# EAGLE design mend (EAGLE 7.2.0)
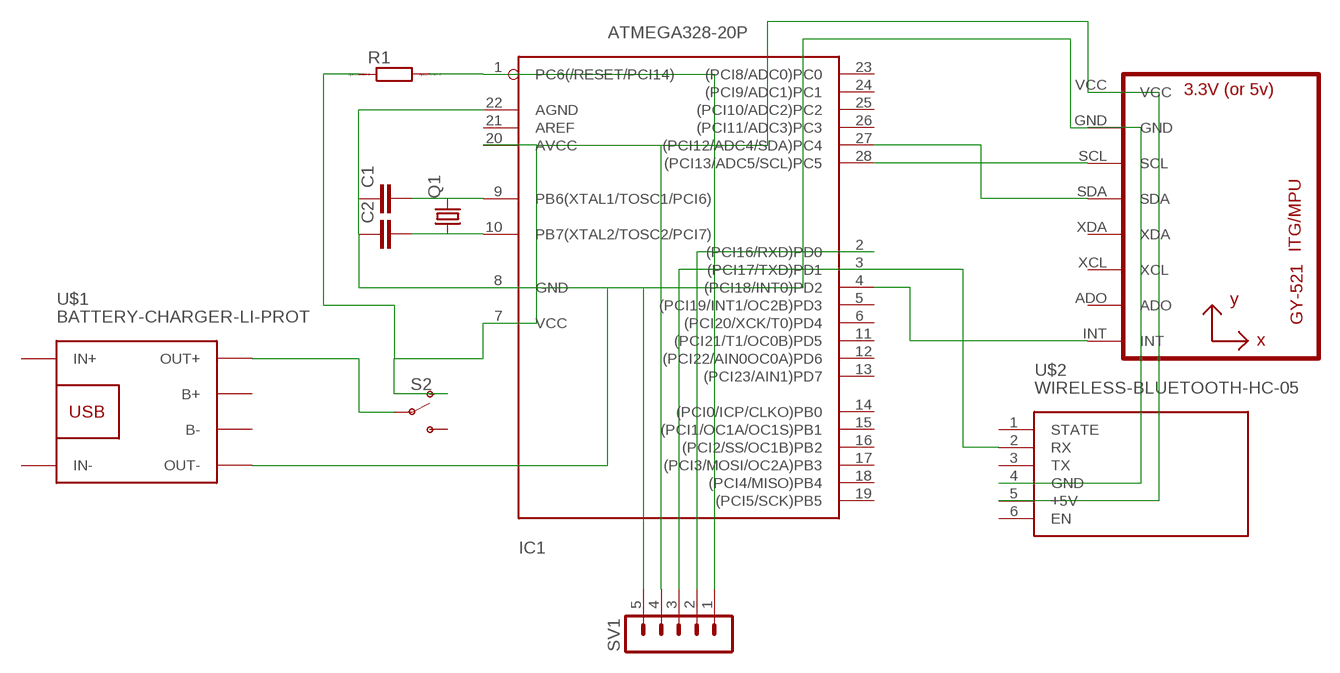
[diagram p0: schematic, sheet 1]

## Parts
C1  C2.5/2  [C2.5-2]
C2  C2.5/2  [C2.5-2]
IC1  ATMEGA328-20P  [DIL28-3]
Q1  CRYSTALHC49S  [HC49/S]
R1  R0204/7  [0204/7]
S2  SWITCH-SPDT-PTH-8.6X4.3MM-LOCK  [SWITCH_SPDT_8.6X4.3MM_LOCK]
SV1  MA05-1  [MA05-1]
U1  GY-521MPU6050  [GY-521]
U$1  BATTERY-CHARGER-LI-PROT  [BATTERY-CHARGER-LI-PROT]
U$2  WIRELESS-BLUETOOTH-HC-05  [WIRELESS-BLUETOOTH-HC-05]

## Nets
N$1: C1.2 IC1.9(PB6(XTAL1/TOSC1/PCI6)) Q1.2
N$2: C2.2 IC1.10(PB7(XTAL2/TOSC2/PCI7)) Q1.1
N$5: IC1.2((PCI16/RXD)PD0) SV1.2
N$6: IC1.28((PCI13/ADC5/SCL)PC5) U1.SCL
N$7: IC1.27((PCI12/ADC4/SDA)PC4) U1.SDA
N$8: IC1.3((PCI17/TXD)PD1) SV1.3 U$2.2(RX)
N$13: IC1.4((PCI18/INT0)PD2) U1.INT
N$14: S2.2(P) U$1.OUT+
N$16: IC1.1(PC6(/RESET/PCI14)) R1.2 SV1.1
N$17: IC1.7(VCC) IC1.20(AVCC) R1.1 S2.1(O) SV1.4 U1.VCC U$2.5(+5V)
N$18: C1.1 C2.1 IC1.8(GND) IC1.22(AGND) SV1.5 U1.GND U$1.OUT- U$2.4(GND)
Unconnected: IC1.5((PCI19/INT1/OC2B)PD3) IC1.6((PCI20/XCK/T0)PD4) IC1.11((PCI21/T1/OC0B)PD5) IC1.12((PCI22/AIN0OC0A)PD6) IC1.13((PCI23/AIN1)PD7) IC1.14((PCI0/ICP/CLKO)PB0) IC1.15((PCI1/OC1A/OC1S)PB1) IC1.16((PCI2/SS/OC1B)PB2) IC1.17((PCI3/MOSI/OC2A)PB3) IC1.18((PCI4/MISO)PB4) IC1.19((PCI5/SCK)PB5) IC1.21(AREF) IC1.23((PCI8/ADC0)PC0) IC1.24((PCI9/ADC1)PC1) IC1.25((PCI10/ADC2)PC2) IC1.26((PCI11/ADC3)PC3) S2.3(S) U1.ADO U1.XCL U1.XDA U$1.B+ U$1.B- U$1.IN+ U$1.IN- U$2.1(STATE) U$2.3(TX) U$2.6(EN)

## Library data of the parts
C1 C2 = capacitor-wima:C: CAPACITOR naming: grid - package width
IC1 = atmega328:ATMEGA328*P: MICROCONTROLLER 32 kBytes FLASH 2 kBytes SRAM 1 kBytes EEPROM USART 8-channel 10 bit ADC
Q1 = crystal:CRYSTAL: CRYSTAL; OC_FARNELL: 1667008; OC_NEWARK: unknown
R1 = eagle-ltspice:R: RESISTOR, European symbol; SPICEMODEL: NONE; SPICEPREFIX: R
S2 = SparkFun-Switches:SWITCH-SPDT: Single Pole, Double Throw (SPDT) Switch Single-pole, double-throw (SPDT) switch. Variant Overview SMD-AYZ0202 Surface Mount DPDT Switch <https://www.sparkfun.com/products/597> (COM-00597) Used on e.g. LilyPad Arduino USB - ATmega32U4 Board <https://www.sparkfun.com/products/12049> PTH-11.6X4.0MM SPDT Mini Power Switch <https://www.sparkfun.com/products/102> (COM-00102) Used on e.g. SparkFun Simon Says - Through-Hole Soldering Kit <https://www.sparkfun.com/products/10547> (KIT-10547) PTH-11.6X4.0MM-KIT KIT version of SPDT Mini Power Switch - Simplifies soldering by removing tStop of switch pins - only one side can be soldered. PTH-11.6X4.0MM-LOCK LOCK version of SPDT Mini Power Switch - Offset pins hold switch in place for easier soldering. SMD-RIGHT-ANGLE Surface Mount Right Angle Switch <https://www.sparkfun.com/products/10860> (COM-10860) Used on e.g. SparkFun ESP8266 Thing <https://www.sparkfun.com/products/13231>; PROD_ID: SWCH-14746
SV1 = con-lstb:MA05-1: PIN HEADER; OC_FARNELL: unknown; OC_NEWARK: unknown
U1 = gy-521:GY-521
U$1 = diy-modules:BATTERY-CHARGER-LI-PROT: Lithium Battery 5V Charger with protection circuit More details available here: http://www.instructables.com/id/DIY-Lithium-ion-Battery-Charger/step4/TP4056-based-lithium-ion-battery-charger-module/ Click here to find device on ebay.com <http://www.ebay.com/sch/tp4056+charger+usb+protection>
U$2 = diy-modules:WIRELESS-BLUETOOTH-HC-05: Bluetooth Transceiver Module based on HC-05 board Tutorial is available here: https://arduino-info.wikispaces.com/BlueTooth-HC05-HC06-Modules-How-To Click here to find device on ebay.com <http://www.ebay.com/sch/hc-05+module+rs232>

## Net classes
0 default: width 0.5 mm

## Board
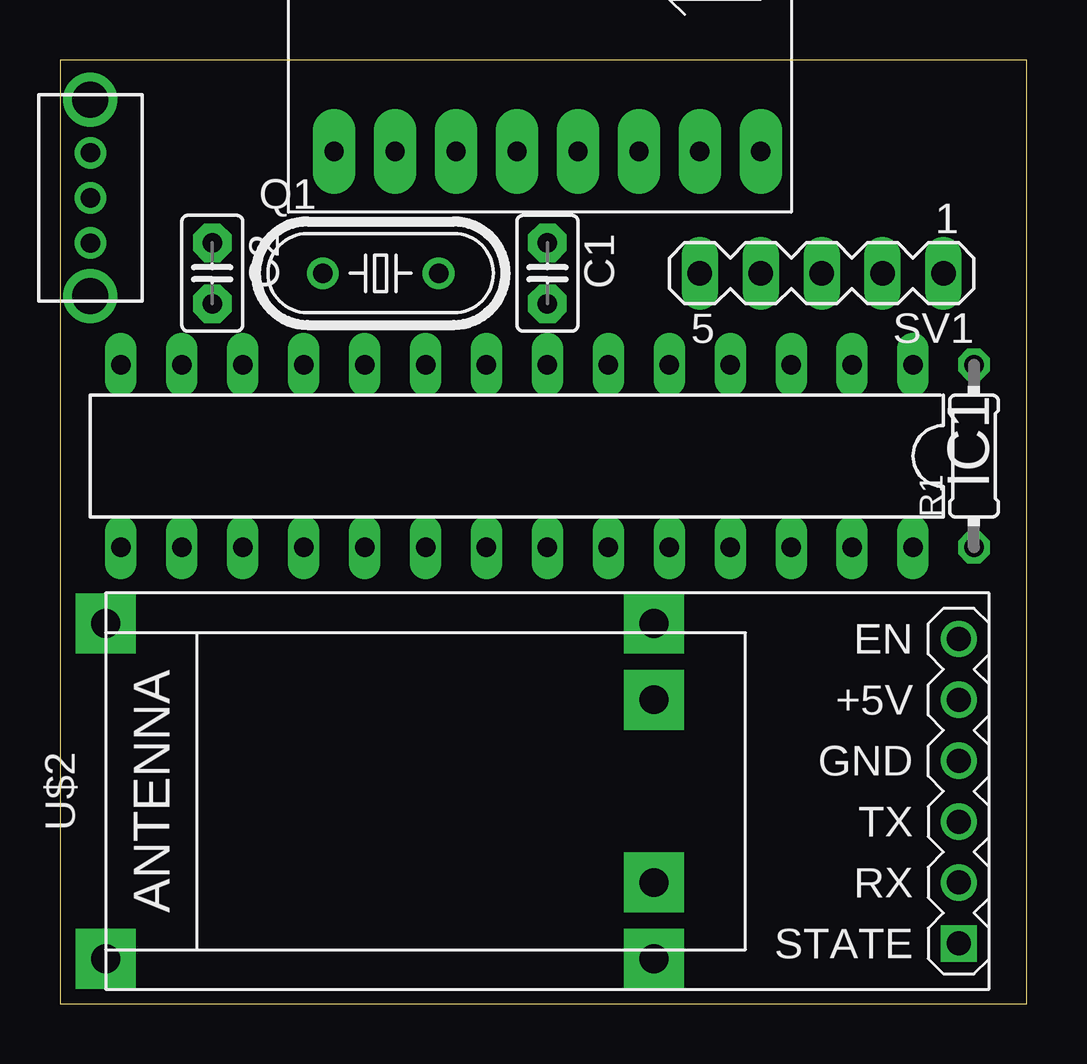
[diagram p1: board, top side]
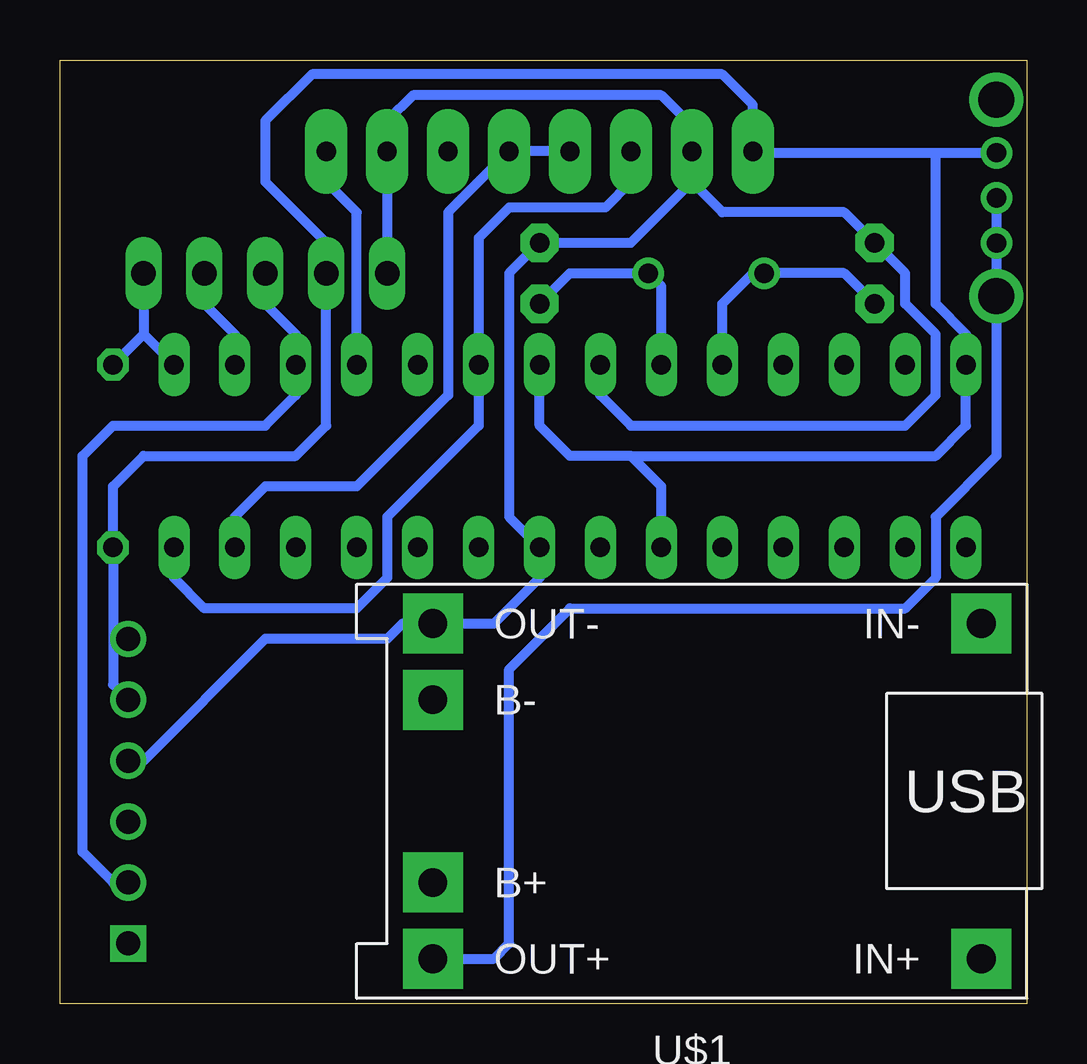
[diagram p2: board, bottom side, seen from below]

Size 40.31 x 39.35 mm. Coordinates in mm from the lower left corner, seen from the top.
Outline: 0,39.35 0,0 40.31,0 40.31,39.35 0,39.35
Copper layers (1*16): Top 0.035mm / dielectric 1.5mm / Bottom 0.035mm
Design rules "default": minimum track width 10mil, minimum drill 24mil, track to track 8mil, track to pad 8mil, pad to pad 8mil, via to via 8mil, smd to smd 8mil, copper to edge 40mil, drill to drill 8mil, minimum pad ring 10mil, minimum via ring 8mil, stop-mask expansion 4mil, vias tented up to drill 0mil, thermal gap 10mil

### Footprints (pad centres in the part's own frame; a part is rotated, then mirrored left to right if it is on the bottom)
C2.5-2 = drill 0.813 pad 1.6 octagon: 1 -1.27,0; 2 1.27,0
DIL28-3 = drill 0.813 long: 1 -16.51,-3.81; 2 -13.97,-3.81; 3 -11.43,-3.81; 4 -8.89,-3.81; 5 -6.35,-3.81; 6 -3.81,-3.81; 7 -1.27,-3.81; 8 1.27,-3.81; 9 3.81,-3.81; 10 6.35,-3.81; 11 8.89,-3.81; 12 11.43,-3.81; 13 13.97,-3.81; 14 16.51,-3.81; 15 16.51,3.81; 16 13.97,3.81; 17 11.43,3.81; 18 8.89,3.81; 19 6.35,3.81; 20 3.81,3.81; 21 1.27,3.81; 22 -1.27,3.81; 23 -3.81,3.81; 24 -6.35,3.81; 25 -8.89,3.81; 26 -11.43,3.81; 27 -13.97,3.81; 28 -16.51,3.81
HC49/S = drill 0.813: 1 -2.413,0; 2 2.413,0
0204/7 = drill 0.813 octagon: 1 -3.81,0; 2 3.81,0
SWITCH_SPDT_8.6X4.3MM_LOCK = drill 0.8: 1 -1.88,0; 2 0,0; 3 1.88,0 | drill 1.5: 4 -4.1,0; 5 4.1,0
MA05-1 = drill 1.016 long: 1 -5.08,0; 2 -2.54,0; 3 0,0; 4 2.54,0; 5 5.08,0
GY-521 = drill 0.8 pad 1.778 long: ADO -8.89,-6.35; GND -8.89,6.35; INT -8.89,-8.89; SCL -8.89,3.81; SDA -8.89,1.27; VCC -8.89,8.89; XCL -8.89,-3.81; XDA -8.89,-1.27
BATTERY-CHARGER-LI-PROT = drill 1.2 pad 2.5 square: B+ 10.795,3.81; B- 10.795,-3.81; IN+ -12.065,6.985; IN- -12.065,-6.985; OUT+ 10.795,6.985; OUT- 10.795,-6.985
WIRELESS-BLUETOOTH-HC-05 = drill 1 square: 1 -6.35,-17.145 | drill 1: 2 -3.81,-17.145; 3 -1.27,-17.145; 4 1.27,-17.145; 5 3.81,-17.145; 6 6.35,-17.145

### Placement (x,y rotation side)
C1  20.32,30.46 270 top
C2  6.35,30.46 270 top
IC1  19.05,22.84 180 top
Q1  13.37,30.46 0 top
R1  38.1,22.84 90 top
S2  1.27,33.6 270 top
SV1  31.75,30.46 180 top
U1  20.32,44.43 90 top
U$1  13.97,8.87 180 bottom
U$2  20.32,8.87 90 top

### Tracks (layer width: path | path; a pad name or v marks a point on that pad's centre or on a via)
N$1
  Bottom 0.406: IC1.9 15.24,29.92 Q1.2 19.05,30.46 C1.2
N$2
  Bottom 0.406: IC1.10 12.7,29.19 11.43,30.46 Q1.1 7.62,30.46 C2.2
N$5
  Bottom 0.406: IC1.2 33.02,27.92 34.29,29.19 SV1.2
N$6
  Bottom 0.406: U1.SCL 16.51,34.27 17.58,33.2 21.59,33.2 22.86,31.93 22.86,24.11 26.67,20.3 26.67,17.76 27.94,16.49 34.29,16.49 35.56,17.76 IC1.28
N$7
  Bottom 0.406: IC1.27 33.02,20.3 31.75,21.57 27.94,21.57 24.13,25.38 24.13,33 21.59,35.54 U1.SDA
N$8
  Bottom 0.406: U$2.2 38.1,5.06 39.37,6.33 39.37,22.84 38.1,24.11 31.75,24.11 30.48,25.38 IC1.3 30.48,27.92 31.75,29.19 SV1.3
N$13
  Bottom 0.406: IC1.4 27.94,33 29.21,34.27 U1.INT
N$14
  Bottom 0.406: U$1.OUT+ 22.23,1.89 21.59,2.52 21.59,13.95 19.05,16.49 5.08,16.49 3.81,17.76 3.81,20.3 1.27,22.84 S2.2
N$16
  Bottom 0.406: SV1.1 36.83,27.92 | 36.83,27.92 IC1.1 | R1.2 36.83,27.92
N$17
  Bottom 0.406: IC1.20 15.24,21.57 16.51,22.84 | 16.51,22.84 19.05,22.84 20.32,24.11 IC1.7 | 16.51,22.84 3.81,22.84 2.54,24.11 2.54,27.92 3.81,29.19 3.81,35.48 | 3.81,35.48 11.37,35.48 U1.VCC 11.43,37.48 12.7,38.75 29.81,38.75 31.75,36.81 31.75,34.27 29.21,31.73 SV1.4 29.21,24.11 30.48,22.84 36.83,22.84 38.1,21.57 R1.1 38.1,13.32 U$2.5 | 3.81,35.48 S2.1
N$18
  Bottom 0.406: U$2.4 36.83,10.14 31.75,15.22 26.67,15.22 26.04,15.86 U$1.OUT- 22.23,15.86 20.32,17.76 IC1.22 21.59,20.3 21.59,30.46 C1.1 16.51,31.73 13.97,34.27 | C2.1 | 13.97,34.27 U1.GND 13.97,36.61 15.24,37.88 25.6,37.88 26.67,36.81 SV1.5 | 13.97,34.27 12.7,33 7.62,33 C2.1 | IC1.8 17.78,25.38 16.51,24.11 5.08,24.11 3.81,25.38 3.81,27.92 5.08,29.19 5.08,30.46 C2.1